# Altium schematic sheet schematic.SchDoc: <Project Name>
size A4; ENG_APP_DATE: --/--/--; DSN_APP_DATE: --/--/--; CHK_APP_DATE: --/--/--; Engineer: Engineer; Address4: Thành phố Hồ Chí Minh; DocumentNumber: 1; Revision: 1.0; SheetNumber: 1; SheetTotal: 1
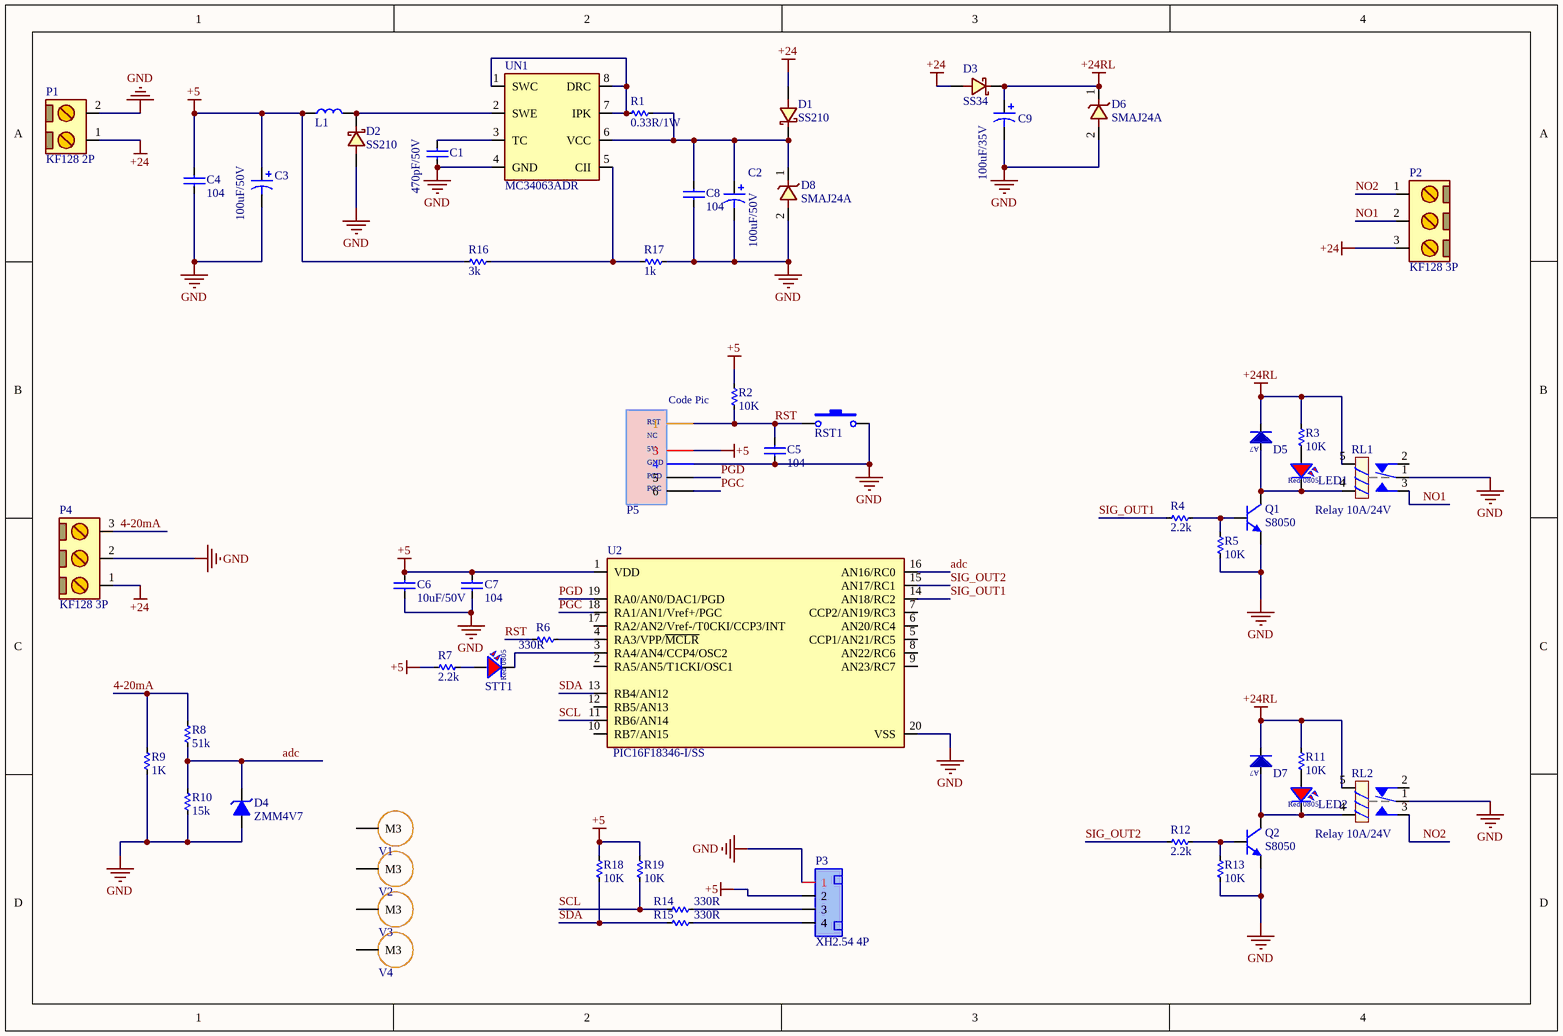
[diagram p0: schematic.SchDoc]

## Parts
C1  470pF/50V  [C_0805_SMD]
C2  100uF/50V  [C_8X12]
C3  100uF/50V  [C_8X12]
C4  104  [C_0805_SMD]
C5  104  [C_0805_SMD]
C6  10uF/50V  [C_0805_SMD]
C7  104  [C_0805_SMD]
C8  104  [C_0805_SMD]
C9  100uF/35V  [C_6.3x12]
D1  SS210  [D_SMA]
D2  SS210  [D_SMA]
D3  SS34  [D_SMA]
D4  ZMM4V7  [SOD80C_MFG]
D5  1N4007  [DIODE_SOD123-FL]  (value not drawn)
D6  SMAJ24A  [DO_241AC_SMA_MFG]
D7  1N4007  [DIODE_SOD123-FL]  (value not drawn)
D8  SMAJ24A  [DO_241AC_SMA_MFG]
L1  220uH  [CDRH127]  (value not drawn)
LED1  LED RED  [LED 0805 Red]  (value not drawn)
LED2  LED RED  [LED 0805 Red]  (value not drawn)
P1  KF128 2P  [KF128 5.08 2P]
P2  KF128 3P  [KF128 5.08 3P]
P3  XH2.54 4P  [XH2.54_4P_RA]
P4  KF128 3P  [KF128 5.08 3P]
P5  HDR 6 Male  [Header Code Pic 2.54 6P]  (value not drawn)  (no BOM)
Q1  S8050  [SOT23_N NXP]
Q2  S8050  [SOT23_N NXP]
R1  0.33R/1W  [RES-SMD-2512]
R2  10K  [RES-SMD-0805]
R3  10K  [RES-SMD-0805]
R4  2.2k  [RES-SMD-0805]
R5  10K  [RES-SMD-0805]
R6  330R  [RES-SMD-0805]
R7  2.2k  [RES-SMD-0805]
R8  51k  [RES-SMD-0805]
R9  1K  [RES-SMD-2512]
R10  15k  [RES-SMD-0805]
R11  10K  [RES-SMD-0805]
R12  2.2k  [RES-SMD-0805]
R13  10K  [RES-SMD-0805]
R14  330R  [RES-SMD-0805]
R15  330R  [RES-SMD-0805]
R16  3k  [RES-SMD-0805]
R17  1k  [RES-SMD-0805]
R18  10K  [RES-SMD-0805]
R19  10K  [RES-SMD-0805]
RL1  Relay 10A/24V  [Relay 5 pin 10A]
RL2  Relay 10A/24V  [Relay 5 pin 10A]
RST1  SW-SMD  [SW-SMD 3x6 mm]  (value not drawn)
STT1  LED RED  [LED 0805 Red]  (value not drawn)
U2  PIC16F18346-I/SS  [SOG65_20_W]
UN1  MC34063ADR  [SO_8]
V1  Vit m3  [Screw M3x5 - Via]  (value not drawn)  (no BOM)
V2  Vit m3  [Screw M3x5 - Via]  (value not drawn)  (no BOM)
V3  Vit m3  [Screw M3x5 - Via]  (value not drawn)  (no BOM)
V4  Vit m3  [Screw M3x5 - Via]  (value not drawn)  (no BOM)

## Nets
+5: C3.1 C4.2 C6.2 C7.2 L1.1 P3.2 P5.3 R2.1 R7.2 R16.2 R18.1 R19.1 U2.1(VDD)
+24: D1.1(A) D3.1(A) P1.1 P2.3 P4.1
+24RL: C9.1 D3.2(K) D5.K D6.1 D7.K R3.1 R11.1 RL1.5 RL2.5
GND: C1.1 C2.2 C3.2 C4.1 C5.1 C6.1 C7.1 C8.1 C9.2 D2.1(A) D4.2(A) D6.2 D8.2 P1.2 P3.1 P4.2 P5.4 Q1.2(E) Q2.2(E) R5.2 R9.1 R10.2 R13.2 R17.2 RL1.1 RL2.1 RST1.2 U2.20(VSS) UN1.4(GND)
4-20mA: P4.3 R8.1 R9.2
adc: D4.1(K) R8.2 R10.1 U2.16(AN16/RC0)
NO1: P2.2 RL1.3
NO2: P2.1 RL2.3
PGC: P5.6 U2.18(RA1/AN1/Vref+/PGC)
PGD: P5.5 U2.19(RA0/AN0/DAC1/PGD)
RST: C5.2 P5.1 R2.2 R6.2 RST1.1
SCL: R14.2 R19.2 U2.11(RB6/AN14)
SDA: R15.2 R18.2 U2.13(RB4/AN12)
SIG_OUT1: R4.2 U2.14(AN18/RC2)
SIG_OUT2: R12.2 U2.15(AN17/RC1)
NetC1_2: C1.2 UN1.3(TC)
NetC2_1: C2.1 C8.2 D1.2(K) D8.1 R1.1 UN1.6(VCC)
NetD2_2: D2.2(K) L1.2 UN1.2(SWE)
NetD5_A: D5.A LED1.2 Q1.3(C) RL1.4
NetD7_A: D7.A LED2.2 Q2.3(C) RL2.4
NetLED1_1: LED1.1 R3.2
NetLED2_1: LED2.1 R11.2
NetP3_3: P3.3 R14.1
NetP3_4: P3.4 R15.1
NetQ1_1: Q1.1(B) R4.1 R5.1
NetQ2_1: Q2.1(B) R12.1 R13.1
NetR1_2: R1.2 UN1.1(SWC) UN1.7(IPK) UN1.8(DRC)
NetR6_1: R6.1 U2.4(RA3/VPP/~{MCLR})
NetR7_1: R7.1 STT1.1
NetR16_1: R16.1 R17.1 UN1.5(CII)
NetSTT1_2: STT1.2 U2.3(RA4/AN4/CCP4/OSC2)

Not connected (* = marked no-connect by the designer): RL1 2; RL2 2; U2 2(RA5/AN5/T1CKI/OSC1) 5(CCP1/AN21/RC5) 6(AN20/RC4) 7(CCP2/AN19/RC3) 8(AN22/RC6) 9(AN23/RC7) 10(RB7/AN15) 12(RB5/AN13) 17(RA2/AN2/Vref-/T0CKI/CCP3/INT); V1 1(M3); V2 1(M3); V3 1(M3); V4 1(M3)

## Notes on the sheet
- Title
- Size:
- Date:
- A4
- Number:
- Time:
- Revision:
- Sheet
- of
- File:
- (in symbol 1n4007W-A7-SOD-123FL) A7
- (in symbol Header Code PIC) Code Pic; RST; NC; 5V; GND; PGD; PGC
- (in symbol LED 0805 RED) 0805; Red

## Library data of the parts
C1 = Cap 0805 470pF 50V: Cap SMD 0805  470pF 50V; Code: 1438-056
C2 C3 = Cap Pol 100uF/50V: Polarized Capacitor (Axial) 100uF 50V; Code: N/A
C4 C5 C7 C8 = Cap 0805 104 100nF: Cap SMD 0805 104-100nF-0.1uF 50V; Code: 1438-080
C6 = Cap 0805 10uF 50V: Cap SMD 0805 10uF 50V; Code: 1438-100
C9 = Cap Pol 100uF/35V: Polarized Capacitor (Axial) 100uF 35V; Code: 1402-225
D1 D2 = SS210-SMA: Surface-Mount Schottky Barrier Rectifier; Code: 2005-026
D3 = SS34-SMA: Surface-Mount Schottky Barrier Rectifier; Code: 2005-008
D4 = ZMM4V7 Diode Zener: zener 4.7V 500mW SMD; Code: 2003-015; Designed by: Nhox
D5 D7 = 1n4007W-A7-SOD-123FL: Rectifier diode 1n4007-A7 SOD-123FL; Code: 2001-069; Designed by: TranLuyen
D6 D8 = TVS SMAJ24A-DO241AC: SMAJ Series 400W Surface Mount Uni-Directional TVS Diode - DO-214AC; Designed by: TranLuyen; Code: N/A
L1 = IND 1280-221 220uH 1.9A: CDRH127 size 12 x 12 x 8mm; Code: 1523-011; Designed by: TranLuyen
LED1 LED2 STT1 = LED 0805 RED: LED 0805 SMD RED; Code: 8600-017; Designed by: TranLuyen
P1 = KF128-5.08-2P-5.08mm: Header, 2-Pin, Medium KF128 2P-5.08mm; Code: 3520-013; Designed by: TranLuyen; ComponentLink1 Description: Manufacturer; ComponentLink2 Description: Datasheet; ComponentLink1URL: http://www.we-online.com; ComponentLink2URL: http://katalog.we-online.de/em/datasheet/6911031100xx.pdf
P2 P4 = KF128-5.08-3P-5.08mm: Header, 3-Pin, Medium KF128 3P-5.08mm; Code: 3520-014; Designed by: TranLuyen
P3 = XH2.54_4P_RA: XH2.54 RA; Code: 3509-012
P5 = Header Code PIC: Header 6-5Pin; Code: NULL
Q1 Q2 = S8050 SOT-23: J3Y-NPN SMD Transistor SOT23; Code: 1701-070
R1 = Res 0.33R 2512 1W: Resistor SMD 2512 1W; Code: 1032-007
R2 R3 R5 R11 R13 R18 R19 = Res 10k 0805: Resistor SMD 0805; Code: 1024-111
R4 R7 R12 = Res 2.2K 0805: Resistor SMD 0805; Code: 1024-094
R6 R14 R15 = Res 330R 0805: Resistor SMD 0805; Code: 1024-074
R8 = Res 51K 0805: Resistor SMD 0805; Code: 1025-127
R9 = Res 1K 2512: RES 2512 1W; Code: 1032-086
R10 = Res 15K 0805: Resistor SMD 0805; Code: 1024-116
R16 = Res 3k 0805: Resistor SMD 0805; Code: 1024-098; Designed by: TranLuyen
R17 = Res 1k 0805: Resistor SMD 0805; Code: 1024-086
RL1 RL2 = Relay 24V 5 Pin 10A SLC: Relay SPDT,10A - 24VDC 5 Pin SONGLE SLC; Code: 2404-012
RST1 = SW2 SMD 3x6: Button 3x6 mm x 2.5mm 2Pin SMD; Code: 3606-006
U2 = PIC16F18346-I/SS: IC MCU 8BIT 28KB FLASH 20SSOP; Code: N/A
UN1 = MC34063ADR: MC3x063A 1.5-A Peak Boost/Buck/Inverting Switching Regulators; Code: 5015-078; Designed by: TranLuyen; ComponentLink1Description: Datasheet; ComponentLink1URL: http://www.ti.com/lit/ds/symlink/mc33063a.pdf?src-supplier=Digi-Key
V1-V4 = Screw Vit m3: Code: N/A